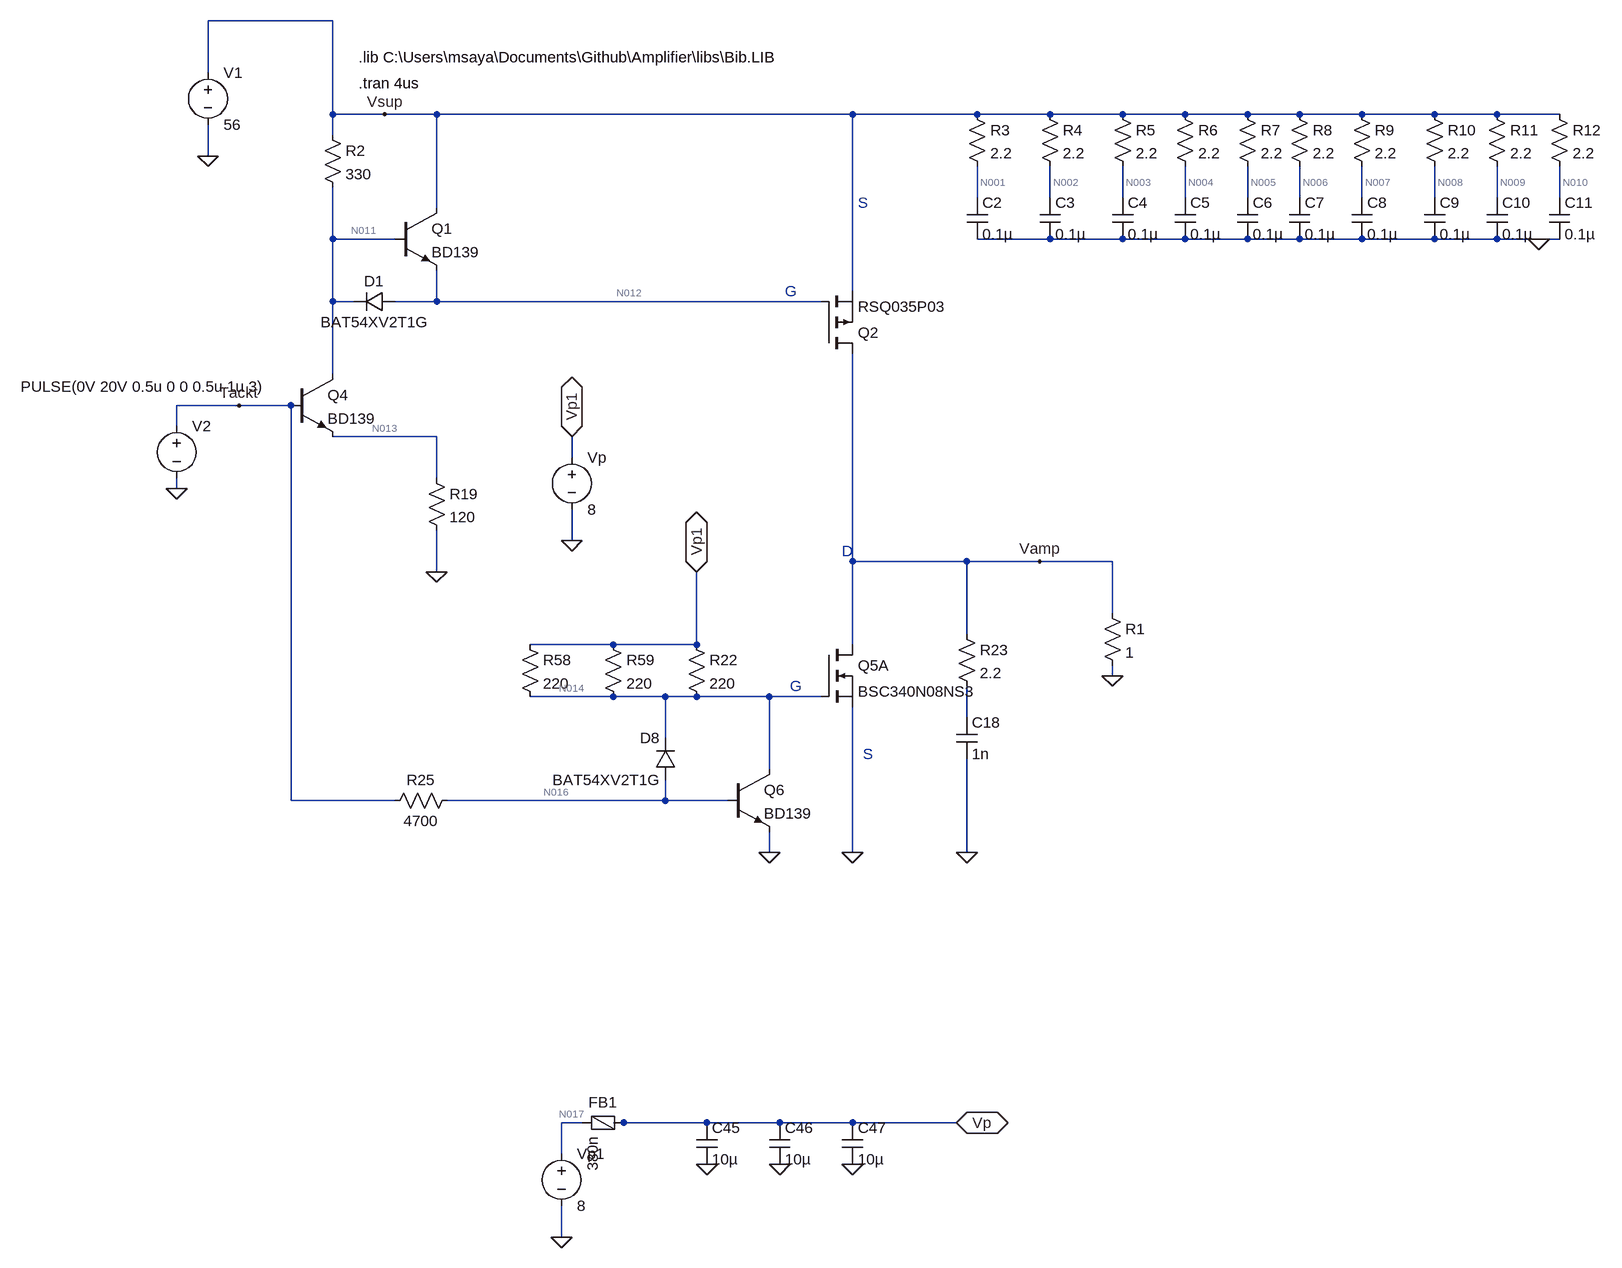
[diagram p0: schematic Switch.asc]
Switch.asc, the LTspice schematic file:
Version 4
SHEET 1 7116 2452
WIRE 192 -416 0 -416
WIRE 0 -336 0 -416
WIRE 192 -272 192 -416
WIRE 272 -272 192 -272
WIRE 352 -272 272 -272
WIRE 992 -272 352 -272
WIRE 1184 -272 992 -272
WIRE 1296 -272 1184 -272
WIRE 1408 -272 1296 -272
WIRE 1504 -272 1408 -272
WIRE 1600 -272 1504 -272
WIRE 1680 -272 1600 -272
WIRE 1776 -272 1680 -272
WIRE 1888 -272 1776 -272
WIRE 1984 -272 1888 -272
WIRE 2080 -272 1984 -272
WIRE 192 -240 192 -272
WIRE 0 -208 0 -256
WIRE 1184 -144 1184 -192
WIRE 1296 -144 1296 -192
WIRE 1408 -144 1408 -192
WIRE 1504 -144 1504 -192
WIRE 1600 -144 1600 -192
WIRE 1680 -144 1680 -192
WIRE 1776 -144 1776 -192
WIRE 1888 -144 1888 -192
WIRE 1984 -144 1984 -192
WIRE 2080 -144 2080 -192
WIRE 352 -128 352 -272
WIRE 192 -80 192 -160
WIRE 288 -80 192 -80
WIRE 1296 -80 1184 -80
WIRE 1408 -80 1296 -80
WIRE 1504 -80 1408 -80
WIRE 1600 -80 1504 -80
WIRE 1680 -80 1600 -80
WIRE 1776 -80 1680 -80
WIRE 1888 -80 1776 -80
WIRE 1984 -80 1888 -80
WIRE 2048 -80 1984 -80
WIRE 2080 -80 2048 -80
WIRE 992 0 992 -272
WIRE 192 16 192 -80
WIRE 224 16 192 16
WIRE 352 16 352 -32
WIRE 352 16 288 16
WIRE 944 16 352 16
WIRE 192 128 192 16
WIRE 48 176 -48 176
WIRE 128 176 48 176
WIRE -48 208 -48 176
WIRE 352 224 192 224
WIRE 560 256 560 224
WIRE 352 288 352 224
WIRE -48 304 -48 288
WIRE 560 384 560 336
WIRE 992 416 992 96
WIRE 1168 416 992 416
WIRE 1280 416 1168 416
WIRE 1392 416 1280 416
WIRE 352 432 352 368
WIRE 1392 496 1392 416
WIRE 1168 528 1168 416
WIRE 624 544 496 544
WIRE 752 544 752 432
WIRE 752 544 624 544
WIRE 992 544 992 416
WIRE 1392 592 1392 576
WIRE 624 624 496 624
WIRE 704 624 624 624
WIRE 752 624 704 624
WIRE 864 624 752 624
WIRE 944 624 864 624
WIRE 1168 656 1168 608
WIRE 704 688 704 624
WIRE 864 736 864 624
WIRE 128 784 128 176
WIRE 288 784 128 784
WIRE 704 784 704 752
WIRE 704 784 368 784
WIRE 800 784 704 784
WIRE 864 864 864 832
WIRE 992 864 992 640
WIRE 1168 864 1168 720
WIRE 576 1280 544 1280
WIRE 640 1280 624 1280
WIRE 768 1280 640 1280
WIRE 880 1280 768 1280
WIRE 992 1280 880 1280
WIRE 1152 1280 992 1280
WIRE 544 1328 544 1280
WIRE 544 1456 544 1408
FLAG 352 432 0
FLAG 0 -208 0
FLAG 1168 864 0
FLAG 864 864 0
FLAG 272 -272 Vsup
FLAG 992 1344 0
FLAG 880 1344 0
FLAG 768 1344 0
FLAG 1152 1280 Vp
IOPIN 1152 1280 BiDir
FLAG 560 384 0
FLAG -48 304 0
FLAG 1280 416 Vamp
FLAG 2048 -80 0
FLAG 992 864 0
FLAG 1392 592 0
FLAG 560 224 Vp1
IOPIN 560 224 BiDir
FLAG 752 432 Vp1
IOPIN 752 432 BiDir
FLAG 544 1456 0
FLAG 48 176 Tackt
SYMBOL voltage 0 -352 R0
WINDOW 123 0 0 Left 0
WINDOW 39 0 0 Left 0
SYMATTR InstName V1
SYMATTR Value 56
SYMBOL res 176 -256 R0
SYMATTR InstName R2
SYMATTR Value 330
SYMATTR SpiceLine pwr=0.5
SYMBOL pmos 944 96 M180
SYMATTR InstName Q2
SYMATTR Value RSQ035P03
SYMBOL nmos 944 544 R0
SYMATTR InstName Q5A
SYMATTR Value BSC340N08NS3
SYMBOL res 1168 -288 R0
SYMATTR InstName R3
SYMATTR Value 2.2
SYMBOL res 1280 -288 R0
SYMATTR InstName R4
SYMATTR Value 2.2
SYMBOL res 1392 -288 R0
SYMATTR InstName R5
SYMATTR Value 2.2
SYMBOL res 1488 -288 R0
SYMATTR InstName R6
SYMATTR Value 2.2
SYMBOL res 1584 -288 R0
SYMATTR InstName R7
SYMATTR Value 2.2
SYMBOL res 1664 -288 R0
SYMATTR InstName R8
SYMATTR Value 2.2
SYMBOL res 1760 -288 R0
SYMATTR InstName R9
SYMATTR Value 2.2
SYMBOL res 1872 -288 R0
SYMATTR InstName R10
SYMATTR Value 2.2
SYMBOL res 1968 -288 R0
SYMATTR InstName R11
SYMATTR Value 2.2
SYMBOL res 2064 -288 R0
SYMATTR InstName R12
SYMATTR Value 2.2
SYMBOL cap 1168 -144 R0
SYMATTR InstName C2
SYMATTR Value 0.1µ
SYMBOL cap 1280 -144 R0
SYMATTR InstName C3
SYMATTR Value 0.1µ
SYMBOL cap 1392 -144 R0
SYMATTR InstName C4
SYMATTR Value 0.1µ
SYMBOL cap 1488 -144 R0
SYMATTR InstName C5
SYMATTR Value 0.1µ
SYMBOL cap 1584 -144 R0
SYMATTR InstName C6
SYMATTR Value 0.1µ
SYMBOL cap 1664 -144 R0
SYMATTR InstName C7
SYMATTR Value 0.1µ
SYMBOL cap 1760 -144 R0
SYMATTR InstName C8
SYMATTR Value 0.1µ
SYMBOL cap 1872 -144 R0
SYMATTR InstName C9
SYMATTR Value 0.1µ
SYMBOL cap 1968 -144 R0
SYMATTR InstName C10
SYMATTR Value 0.1µ
SYMBOL cap 2064 -144 R0
SYMATTR InstName C11
SYMATTR Value 0.1µ
SYMBOL diode 720 752 R180
WINDOW 0 24 64 Left 2
WINDOW 3 24 0 Left 2
SYMATTR InstName D8
SYMATTR Value BAT54XV2T1G
SYMBOL res 480 528 R0
SYMATTR InstName R58
SYMATTR Value 220
SYMATTR SpiceLine pwr=0.5
SYMBOL res 608 528 R0
SYMATTR InstName R59
SYMATTR Value 220
SYMATTR SpiceLine pwr=0.5
SYMBOL res 736 528 R0
SYMATTR InstName R22
SYMATTR Value 220
SYMATTR SpiceLine pwr=0.5
SYMBOL res 384 768 R90
WINDOW 0 0 56 VBottom 2
WINDOW 3 32 56 VTop 2
SYMATTR InstName R25
SYMATTR Value 4700
SYMBOL res 336 272 R0
SYMATTR InstName R19
SYMATTR Value 120
SYMBOL res 1152 512 R0
SYMATTR InstName R23
SYMATTR Value 2.2
SYMBOL cap 1152 656 R0
SYMATTR InstName C18
SYMATTR Value 1n
SYMBOL npn 288 -128 R0
SYMATTR InstName Q1
SYMATTR Value BD139
SYMBOL npn 128 128 R0
SYMATTR InstName Q4
SYMATTR Value BD139
SYMBOL npn 800 736 R0
SYMATTR InstName Q6
SYMATTR Value BD139
SYMBOL diode 288 0 R90
WINDOW 0 0 32 VBottom 2
WINDOW 3 32 32 VTop 2
SYMATTR InstName D1
SYMATTR Value BAT54XV2T1G
SYMBOL cap 976 1280 R0
SYMATTR InstName C47
SYMATTR Value 10µ
SYMBOL cap 864 1280 R0
SYMATTR InstName C46
SYMATTR Value 10µ
SYMBOL cap 752 1280 R0
SYMATTR InstName C45
SYMATTR Value 10µ
SYMBOL FerriteBead 608 1280 R90
WINDOW 0 -16 0 VBottom 2
SYMATTR InstName FB1
SYMATTR Value 380n
SYMATTR SpiceLine Ipk=2.5 Rser=0.0301 Rpar=198 Cpar=1.1p mfg="Würth Elektronik" pn="782853121 WE-CBA 0805"
SYMBOL voltage -48 192 R0
WINDOW 123 0 0 Left 0
WINDOW 39 0 0 Left 0
WINDOW 3 -240 -45 Left 2
SYMATTR Value PULSE(0V 20V 0.5u 0 0 0.5u 1u 3)
SYMATTR InstName V2
SYMBOL voltage 560 240 R0
WINDOW 123 0 0 Left 0
WINDOW 39 0 0 Left 0
SYMATTR InstName Vp
SYMATTR Value 8
SYMBOL res 1376 480 R0
SYMATTR InstName R1
SYMATTR Value 1
SYMBOL voltage 544 1312 R0
WINDOW 123 0 0 Left 0
WINDOW 39 0 0 Left 0
SYMATTR InstName Vp1
SYMATTR Value 8
TEXT 232 -320 Left 2 !.tran 4us
TEXT 232 -360 Left 2 !.lib C:\\Users\\msaya\\Documents\\Github\\Amplifier\\libs\\Bib.LIB
TEXT 888 0 Left 2 ;G
TEXT 896 608 Left 2 ;G
TEXT 976 400 Left 2 ;D
TEXT 1008 712 Left 2 ;S
TEXT 1000 -136 Left 2 ;S

The netlist it stands for:
* Switch.asc
V1 Vsup 0 56
R2 Vsup N011 330 pwr=0.5
M§Q2 Vamp N012 Vsup Vsup RSQ035P03
M§Q5A Vamp N014 0 0 BSC340N08NS3
R3 Vsup N001 2.2
R4 Vsup N002 2.2
R5 Vsup N003 2.2
R6 Vsup N004 2.2
R7 Vsup N005 2.2
R8 Vsup N006 2.2
R9 Vsup N007 2.2
R10 Vsup N008 2.2
R11 Vsup N009 2.2
R12 Vsup N010 2.2
C2 N001 0 0.1µ
C3 N002 0 0.1µ
C4 N003 0 0.1µ
C5 N004 0 0.1µ
C6 N005 0 0.1µ
C7 N006 0 0.1µ
C8 N007 0 0.1µ
C9 N008 0 0.1µ
C10 N009 0 0.1µ
C11 N010 0 0.1µ
D8 N016 N014 BAT54XV2T1G
R58 Vp1 N014 220 pwr=0.5
R59 Vp1 N014 220 pwr=0.5
R22 Vp1 N014 220 pwr=0.5
R25 N016 Tackt 4700
R19 N013 0 120
R23 Vamp N015 2.2
C18 N015 0 1n
Q1 Vsup N011 N012 0 BD139
Q4 N011 Tackt N013 0 BD139
Q6 N014 N016 0 0 BD139
D1 N012 N011 BAT54XV2T1G
C47 Vp 0 10µ
C46 Vp 0 10µ
C45 Vp 0 10µ
L§FB1 Vp N017 380n Ipk=2.5 Rser=0.0301 Rpar=198 Cpar=1.1p mfg="Würth Elektronik" pn="782853121 WE-CBA 0805"
V2 Tackt 0 PULSE(0V 20V 0.5u 0 0 0.5u 1u 3)
Vp Vp1 0 8
R1 Vamp 0 1
Vp1 N017 0 8
.model D D
.lib standard.dio
.model NPN NPN
.model PNP PNP
.lib standard.bjt
.model NMOS NMOS
.model PMOS PMOS
.lib standard.mos
.tran 4us
.lib C:\Users\msaya\Documents\Github\Amplifier\libs\Bib.LIB
* G
* G
* D
* S
* S
.backanno
.end

* Results of the author's LTspice run, read from the files saved beside the schematic
* Operating Point, zero values left out:
*   V(vsup) = 56 V
*   V(n011) = 56 V
*   V(n012) = 56 V
*   V(n014) = 8 V
*   V(n001) = 56 V
*   V(n002) = 56 V
*   V(n003) = 56 V
*   V(n004) = 56 V
*   V(n005) = 56 V
*   V(n006) = 56 V
*   V(n007) = 56 V
*   V(n008) = 56 V
*   V(n009) = 56 V
*   V(n010) = 56 V
*   V(n016) = 117.2 µV
*   V(vp1) = 8 V
*   V(n013) = 304.6 nV
*   V(vp) = 8 V
*   V(n017) = 8 V
*   Ic(Q4) = 8.358 nA
*   Ib(Q4) = -5.82 nA
*   Ie(Q4) = -2.538 nA
*   Ic(Q6) = 6.998 nA
*   Ib(Q6) = -5.756 nA
*   Ie(Q6) = -1.242 nA
*   Id(Q2) = -719.2 pA
*   Is(Q2) = 719.2 pA
*   Id(Q5a) = 752.6 pA
*   Is(Q5a) = -752.6 pA
*   I(D8) = -19.19 nA
*   I(D1) = -4 pA
*   I(R2) = 8.362 nA
*   I(R58) = 8.73 nA
*   I(R59) = 8.73 nA
*   I(R22) = 8.73 nA
*   I(R25) = 24.95 nA
*   I(R19) = 2.538 nA
*   I(R1) = 22.68 pA
*   I(V1) = -9.141 nA
*   I(V2) = 30.77 nA
*   I(Vp) = -26.19 nA
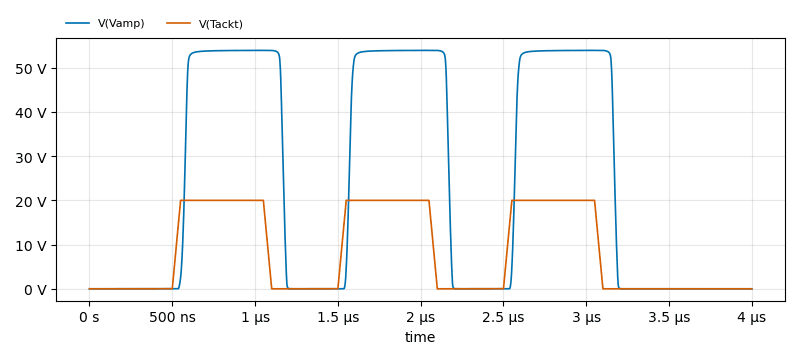
[diagram p1: Transient Analysis of Switch.asc, plotted from the saved traces]
* Transient Analysis, 1 run:
*   V(Vamp): min -534.6 µV, max 53.92 V, average 24.14 V, rms 35.58 V, last 0 V
*   V(Tackt): min 0 V, max 20 V, average 8.25 V, rms 12.65 V, last 0 V